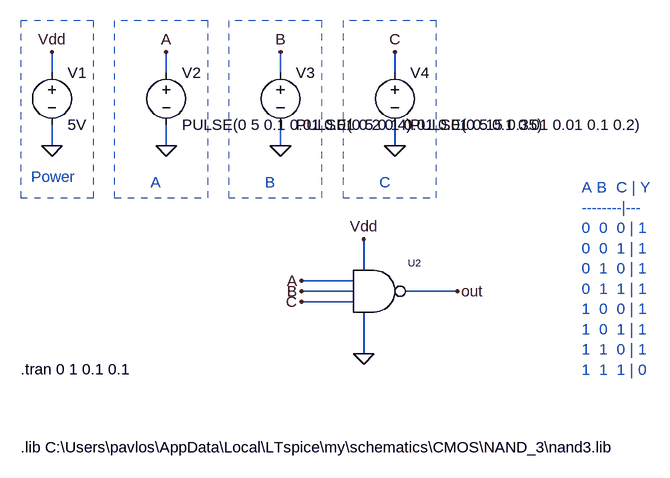
[diagram p0: schematic nand3_block.asc]
nand3_block.asc, the LTspice schematic file:
Version 4
SHEET 1 880 680
WIRE -560 -416 -560 -448
WIRE -384 -416 -384 -448
WIRE -208 -416 -208 -448
WIRE -32 -416 -32 -448
WIRE -560 -304 -560 -336
WIRE -384 -304 -384 -336
WIRE -208 -304 -208 -336
WIRE -32 -304 -32 -336
WIRE -80 -112 -80 -160
WIRE -96 -96 -176 -96
WIRE -96 -80 -176 -80
WIRE 64 -80 -16 -80
WIRE -96 -64 -176 -64
WIRE -80 16 -80 -48
FLAG 64 -80 out
FLAG -176 -96 A
FLAG -80 -160 Vdd
FLAG -80 16 0
FLAG -560 -304 0
FLAG -560 -448 Vdd
FLAG -384 -304 0
FLAG -384 -448 A
FLAG -176 -64 C
FLAG -208 -304 0
FLAG -208 -448 B
FLAG -32 -304 0
FLAG -32 -448 C
FLAG -176 -80 B
SYMBOL voltage -560 -432 R0
WINDOW 123 0 0 Left 0
WINDOW 39 0 0 Left 0
SYMATTR InstName V1
SYMATTR Value 5V
SYMBOL voltage -384 -432 R0
WINDOW 123 0 0 Left 0
WINDOW 39 0 0 Left 0
SYMATTR InstName V2
SYMATTR Value PULSE(0 5 0.1 0.01 0.01 0.2 0.4)
SYMBOL voltage -208 -432 R0
WINDOW 123 0 0 Left 0
WINDOW 39 0 0 Left 0
SYMATTR InstName V3
SYMATTR Value PULSE(0 5 0.1 0.01 0.01 0.15 0.35)
SYMBOL voltage -32 -432 R0
WINDOW 123 0 0 Left 0
WINDOW 39 0 0 Left 0
SYMATTR InstName V4
SYMATTR Value PULSE(0 5 0.1 0.01 0.01 0.1 0.2)
SYMBOL nand3 -96 -48 R0
SYMATTR InstName U2
TEXT -592 -256 Left 2 ;Power
TEXT -408 -248 Left 2 ;A
TEXT -608 40 Left 2 !.tran 0 1 0.1 0.1
TEXT -608 160 Left 2 !.lib C:\\Users\\pavlos\\AppData\\Local\\LTspice\\my\\schematics\\CMOS\\NAND_3\\nand3.lib
TEXT -232 -248 Left 2 ;B
TEXT 256 -240 Left 2 ;A B  C | Y\n--------|---\n0  0  0 | 1\n0  0  1 | 1\n0  1  0 | 1\n0  1  1 | 1\n1  0  0 | 1\n1  0  1 | 1\n1  1  0 | 1\n1  1  1 | 0
TEXT -56 -248 Left 2 ;C
RECTANGLE Normal -496 -496 -608 -224 2
RECTANGLE Normal -320 -496 -464 -224 2
RECTANGLE Normal -144 -496 -288 -224 2
RECTANGLE Normal 32 -496 -112 -224 2

The netlist it stands for:
* nand3_block.asc
V1 Vdd 0 5V
V2 A 0 PULSE(0 5 0.1 0.01 0.01 0.2 0.4)
V3 B 0 PULSE(0 5 0.1 0.01 0.01 0.15 0.35)
V4 C 0 PULSE(0 5 0.1 0.01 0.01 0.1 0.2)
XU2 A B C out Vdd 0 nand3  ; pins A B C Y Vdd Vss
* Power
* A
.tran 0 1 0.1 0.1
.lib C:\Users\pavlos\AppData\Local\LTspice\my\schematics\CMOS\NAND_3\nand3.lib
* B
* A B  C | Y
* --------|---
* 0  0  0 | 1
* 0  0  1 | 1
* 0  1  0 | 1
* 0  1  1 | 1
* 1  0  0 | 1
* 1  0  1 | 1
* 1  1  0 | 1
* 1  1  1 | 0
* C
.backanno
.end